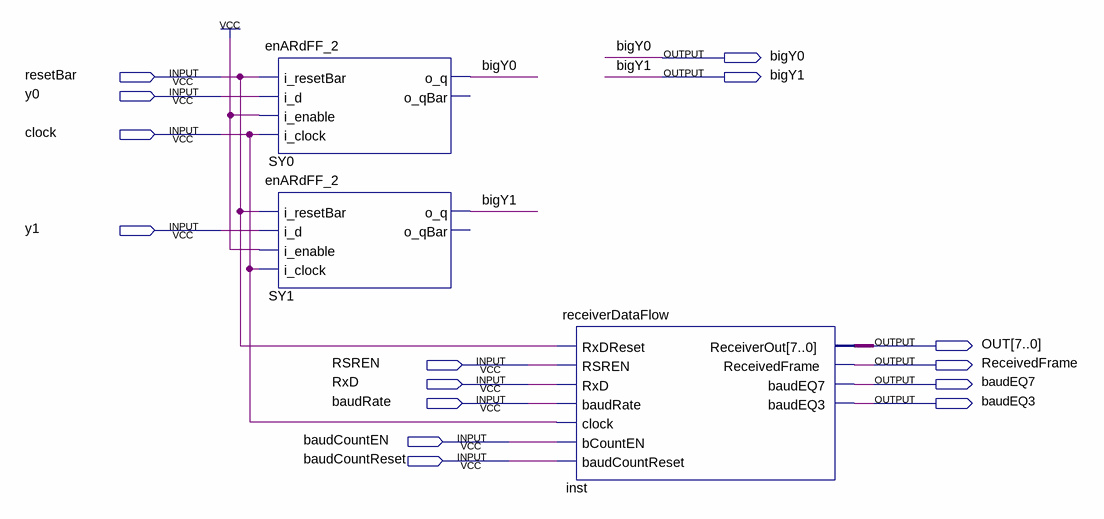
[diagram p0: schematic sheet]
// Quartus schematic test.bdf as structural Verilog: 3 symbols, 15 pins
module test (
  input  resetBar,
  input  y0,
  input  clock,
  input  y1,
  input  RSREN,
  input  RxD,
  input  baudRate,
  input  baudCountEN,
  input  baudCountReset,
  output bigY0,
  output bigY1,
  output [7:0] OUT,
  output ReceivedFrame,
  output baudEQ7,
  output baudEQ3
);

  enARdFF_2 SY0 (.i_resetBar(resetBar), .i_d(y0), .i_enable(1'b1), .i_clock(clock), .o_q(bigY0));  // open: o_qBar
  enARdFF_2 SY1 (.i_resetBar(resetBar), .i_d(y1), .i_enable(1'b1), .i_clock(clock), .o_q(bigY1));  // open: o_qBar
  receiverDataFlow inst (
    .RxDReset(resetBar), .RSREN(RSREN), .RxD(RxD), .baudRate(baudRate), .clock(clock),
    .bCountEN(baudCountEN), .baudCountReset(baudCountReset), .ReceiverOut(OUT),
    .ReceivedFrame(ReceivedFrame), .baudEQ7(baudEQ7), .baudEQ3(baudEQ3));
endmodule
